# Altium schematic sheet PS.SchDoc
size A; Engineer: NH; SheetNumber: 4; SheetTotal: 4
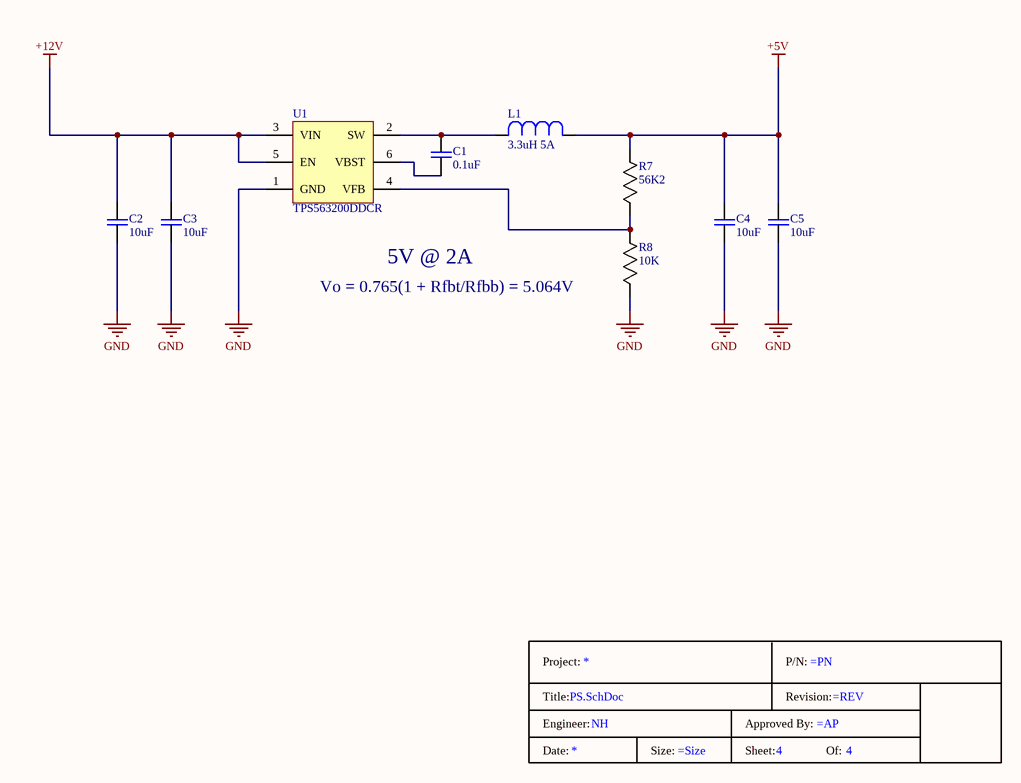
[diagram p0: PS.SchDoc]

## Parts
*  Tital_block_1  (value not drawn)  (graphical)
C1  0.1uF  [C0603]
C2  10uF  [C1206]
C3  10uF  [C1206]
C4  10uF  [C0603]
C5  10uF  [C0603]
L1  3.3uH 5A  [IHLP2020CZER3R3M01]
R7  56K2  [R0603]
R8  10K  [R0603]
U1  TPS563200DDCR  [TI-SOT23]

## Nets
+5V: C4.2 C5.2 L1.1 R7.2
+12V: C2.2 C3.2 U1.3(VIN) U1.5(EN)
GND: C2.1 C3.1 C4.1 C5.1 R8.1 U1.1(GND)
NetC1_1: C1.1 U1.6(VBST)
NetC1_2: C1.2 L1.2 U1.2(SW)
NetR7_1: R7.1 R8.2 U1.4(VFB)

## Notes on the sheet
- 5V @ 2A
- (near R8) Vo = 0.765(1 + Rfbt/Rfbb) = 5.064V
- (in symbol Tital_block_1) Project:; P/N:; Title:; Revision:; Engineer:; Approved By:; Date:; Size:; Sheet:; Of:

## Library data of the parts
C1 = KGM15BR71E104KT: CAP CER 0.1UF 25V X7R 0603; Manufacturer: KYOCERA AVX; Manufacturer P/N: KGM15BR71E104KT
C2 C3 = CL31A106KBHNNNE: CAP CER 10UF 50V X5R 1206; Manufacturer: Samsung Electro-Mechanics; Manufacturer P/N: CL31A106KBHNNNE
C4 C5 = CC0603MRX5R6BB106: CAP CER 10UF 10V X5R 0603; Manufacturer: YAGEO; Manufacturer P/N: CC0603MRX5R6BB106
L1 = IHLP2020CZER3R3M01: Manufacturer: Vishay Dale; Manufacturer P/N: IHLP2020CZER3R3M01
R7 = RC0603FR-0756K2L: RES 56.2K OHM 1% 1/10W 0603; Manufacturer: YAGEO; Manufacturer P/N: RC0603FR-0756K2L
R8 = RMCF0603FT10K0: Manufacturer: Stackpole Electronics Inc; Manufacturer P/N: RMCF0603FT10K0
U1 = TPS563200DDCR: IC REG BUCK ADJ 3A SOT23; Manufacturer: Texas Instruments; Manufacturer P/N: TPS563200DDCR